# Altium schematic sheet Buck-Boost converter.SchDoc
size A4; SheetNumber: 1; SheetTotal: 4
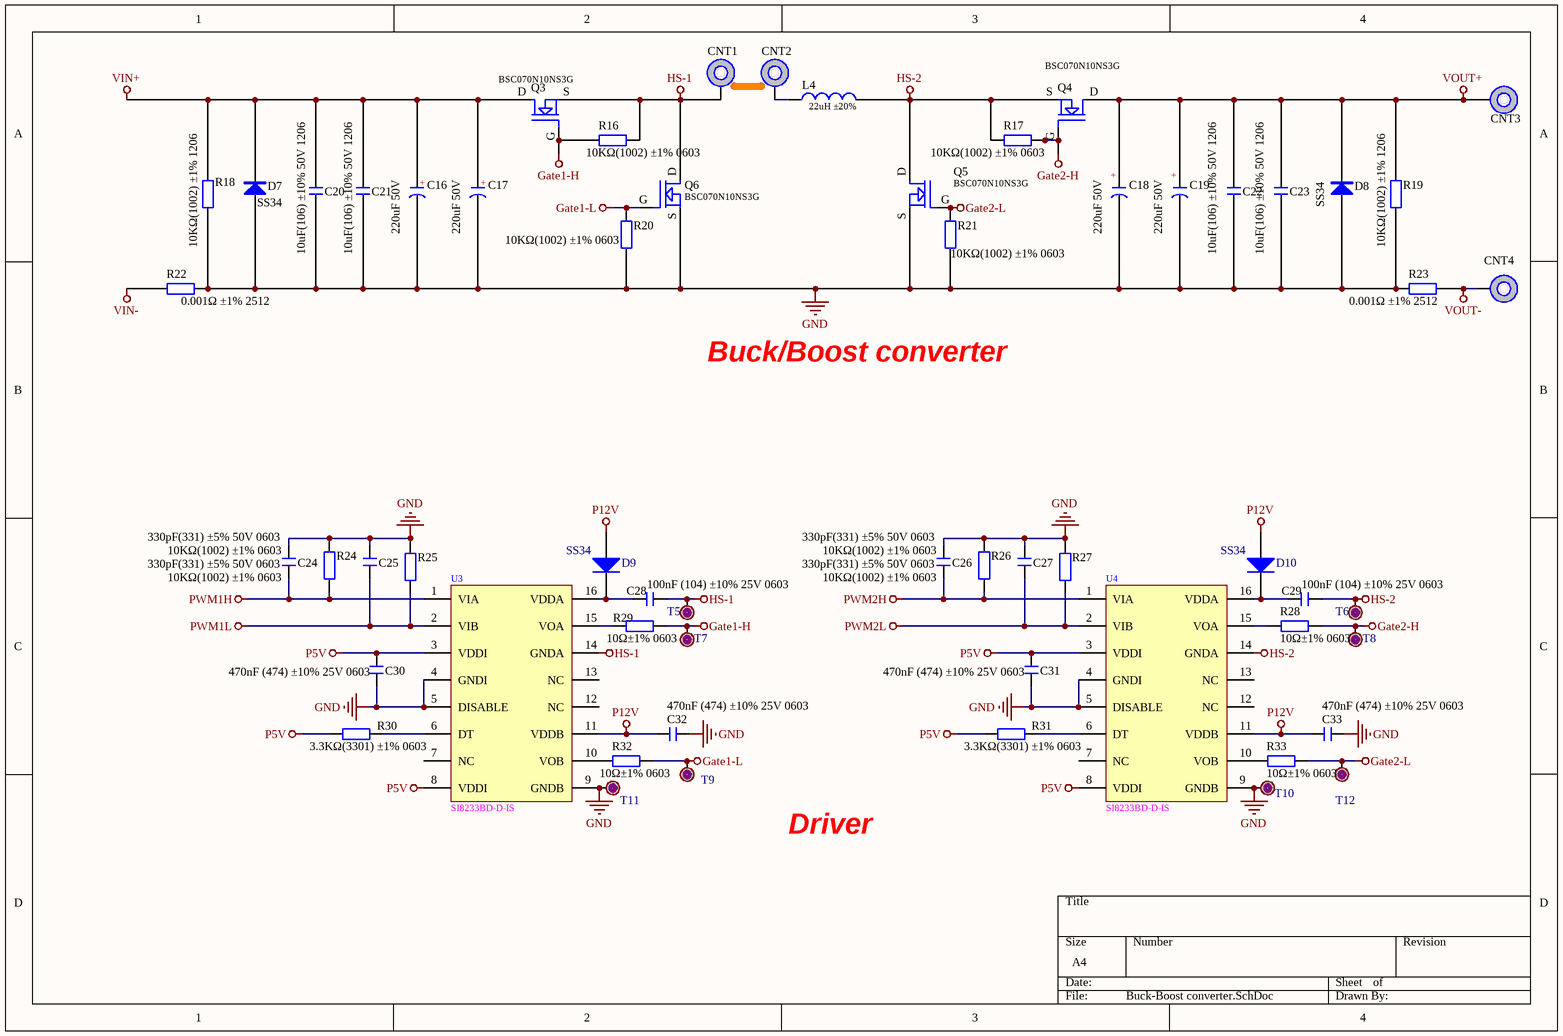
[diagram p0: Buck-Boost converter.SchDoc]

## Parts
C16  220uF 50V  [CE F(10*10.2)]
C17  220uF 50V  [CE F(10*10.2)]
C18  220uF 50V  [CE F(10*10.2)]
C19  220uF 50V  [CE F(10*10.2)]
C20  10uF(106) ±10% 50V 1206  [C 1206_M]
C21  10uF(106) ±10% 50V 1206  [C 1206_M]
C22  10uF(106) ±10% 50V 1206  [C 1206_M]
C23  10uF(106) ±10% 50V 1206  [C 1206_M]
C24  330pF(331) ±5% 50V 0603  [C 0603_L]
C25  330pF(331) ±5% 50V 0603  [C 0603_L]
C26  330pF(331) ±5% 50V 0603  [C 0603_L]
C27  330pF(331) ±5% 50V 0603  [C 0603_L]
C28  100nF (104) ±10% 25V 0603  [C 0603_L]
C29  100nF (104) ±10% 25V 0603  [C 0603_L]
C30  470nF (474) ±10% 25V 0603  [C 0603_L]
C31  470nF (474) ±10% 25V 0603  [C 0603_L]
C32  470nF (474) ±10% 25V 0603  [C 0603_L]
C33  470nF (474) ±10% 25V 0603  [C 0603_L]
CNT1  CST  [M3]  (value not drawn)
CNT2  CST  [M3]  (value not drawn)
CNT3  CST  [M3]  (value not drawn)
CNT4  CST  [M3]  (value not drawn)
D7  SS34  [SMA]
D8  SS34  [SMA]
D9  SS34  [SMA]
D10  SS34  [SMA]
L4  22uH ±20%  [L-SMD-0630]
Q3  BSC070N10NS3G  [PG-TDSON-8_5x6MM]
Q4  BSC070N10NS3G  [PG-TDSON-8_5x6MM]
Q5  BSC070N10NS3G  [PG-TDSON-8_5x6MM]
Q6  BSC070N10NS3G  [PG-TDSON-8_5x6MM]
R16  10KΩ(1002) ±1% 0603  [R 0603_L]
R17  10KΩ(1002) ±1% 0603  [R 0603_L]
R18  10KΩ(1002) ±1% 1206  [R 1206_L]
R19  10KΩ(1002) ±1% 1206  [R 1206_L]
R20  10KΩ(1002) ±1% 0603  [R 0603_L]
R21  10KΩ(1002) ±1% 0603  [R 0603_L]
R22  0.001Ω ±1% 2512  [R2512]
R23  0.001Ω ±1% 2512  [R2512]
R24  10KΩ(1002) ±1% 0603  [R 0603_L]
R25  10KΩ(1002) ±1% 0603  [R 0603_L]
R26  10KΩ(1002) ±1% 0603  [R0805_L]
R27  10KΩ(1002) ±1% 0603  [R 0603_L]
R28  10Ω±1% 0603  [R 0603_L]
R29  10Ω±1% 0603  [R 0603_L]
R30  3.3KΩ(3301) ±1% 0603  [R 0603_L]
R31  3.3KΩ(3301) ±1% 0603  [R 0603_L]
R32  10Ω±1% 0603  [R 0603_L]
R33  10Ω±1% 0603  [R 0603_L]
T5  TestP  [TestP]  (value not drawn)
T6  TestP  [TestP]  (value not drawn)
T7  TestP  [TestP]  (value not drawn)
T8  TestP  [TestP]  (value not drawn)
T9  TestP  [TestP]  (value not drawn)
T10  TestP  [TestP]  (value not drawn)
T11  TestP  [TestP]  (value not drawn)
T12  TestP  [TestP]  (value not drawn)
U3  SI8233BD-D-IS  [SOJ16T]
U4  SI8233BD-D-IS  [SOJ16T]

## Nets
Gate1-H: Q3.G(GATE) R16.1 R29.1 T7.0
Gate1-L: Q6.G(GATE) R20.2 R32.1 T9.0
Gate2-H: Q4.G(GATE) R17.1 R28.1 T8.0
Gate2-L: Q5.G(GATE) R21.2 R33.1 T12.0
GND: C16.2(K) C17.2(K) C18.2(K) C19.2(K) C20.1 C21.1 C22.1 C23.1 C24.2 C25.2 C26.2 C27.2 C30.2 C31.2 C32.1 C33.1 D7.1(A) D8.1(A) Q5.S(SOURCE) Q6.S(SOURCE) R18.1 R19.1 R20.1 R21.1 R22.1 R23.1 R24.2 R25.2 R26.2 R27.2 T10.0 T11.0 U3.4(GNDI) U3.5(DISABLE) U3.9(GNDB) U4.4(GNDI) U4.5(DISABLE) U4.9(GNDB)
HS-1: C28.2 CNT1.1 Q3.S(SOURCE) Q6.D(DRAIN) R16.2 T5.0 U3.14(GNDA)
HS-2: C29.2 L4.2 Q4.S(SOURCE) Q5.D(DRAIN) R17.2 T6.0 U4.14(GNDA)
P5V: C30.1 C31.1 R30.2 R31.2 U3.3(VDDI) U3.8(VDDI) U4.3(VDDI) U4.8(VDDI)
P12V: C32.2 C33.2 D9.1(A) D10.1(A) U3.11(VDDB) U4.11(VDDB)
PWM1H: C24.1 R24.1 U3.1(VIA)
PWM1L: C25.1 R25.1 U3.2(VIB)
PWM2H: C26.1 R26.1 U4.1(VIA)
PWM2L: C27.1 R27.1 U4.2(VIB)
VIN+: C16.1(A) C17.1(A) C20.2 C21.2 D7.2(K) Q3.D(DRAIN) R18.2
VIN-: R22.2
VOUT+: C18.1(A) C19.1(A) C22.2 C23.2 CNT3.1 D8.2(K) Q4.D(DRAIN) R19.2
VOUT-: CNT4.1 R23.2
NetC28_1: C28.1 D9.2(K) U3.16(VDDA)
NetC29_1: C29.1 D10.2(K) U4.16(VDDA)
NetCNT2_1: CNT2.1 L4.1
NetR28_2: R28.2 U4.15(VOA)
NetR29_2: R29.2 U3.15(VOA)
NetR30_1: R30.1 U3.6(DT)
NetR31_1: R31.1 U4.6(DT)
NetR32_2: R32.2 U3.10(VOB)
NetR33_2: R33.2 U4.10(VOB)

Not connected (* = marked no-connect by the designer): U3 7(NC) 12(NC) 13(NC); U4 7(NC) 12(NC) 13(NC)

## Notes on the sheet
- Buck/Boost converter
- Driver
- (in symbol CE) +

## Library data of the parts
C16-C19 = CE: 直插电解电容
C20-C33 = C: 贴片电容; BOM名称: 无极性贴片电容; 淘宝ID: 封装库来自淘宝 ID：黄晶宝石; 联系售后，技术支持: https://shop463601444.taobao.com; 唯一出售店铺网址: https://shop463601444.taobao.com
CNT1-CNT4 = SO3040
D7 D8 = 1N4007: 整流二极管; 淘宝ID: 封装库来自淘宝 ID：黄晶宝石; 封装库来自淘宝卖家 ID：黄晶宝石: 其他店铺购入均为盗版，不享受售后技术支持服务，请立即申请退款; BOM名称: 整流二极管; 联系售后，技术支持: https://shop463601444.taobao.com
D9 D10 = Diode: Default Diode
L4 = Inductor
Q3-Q6 = MOSFET N
R16-R33 = R: 贴片电阻; 版权归属: 来自淘宝 ID：黄晶宝石; 封装库来自淘宝卖家 ID：黄晶宝石: 其他店铺购入均为盗版，不享受售后技术支持服务，请立即申请退款; BOM名称: 贴片电阻; 联系售后: https://shop463601444.taobao.com
U3 U4 = Si8233